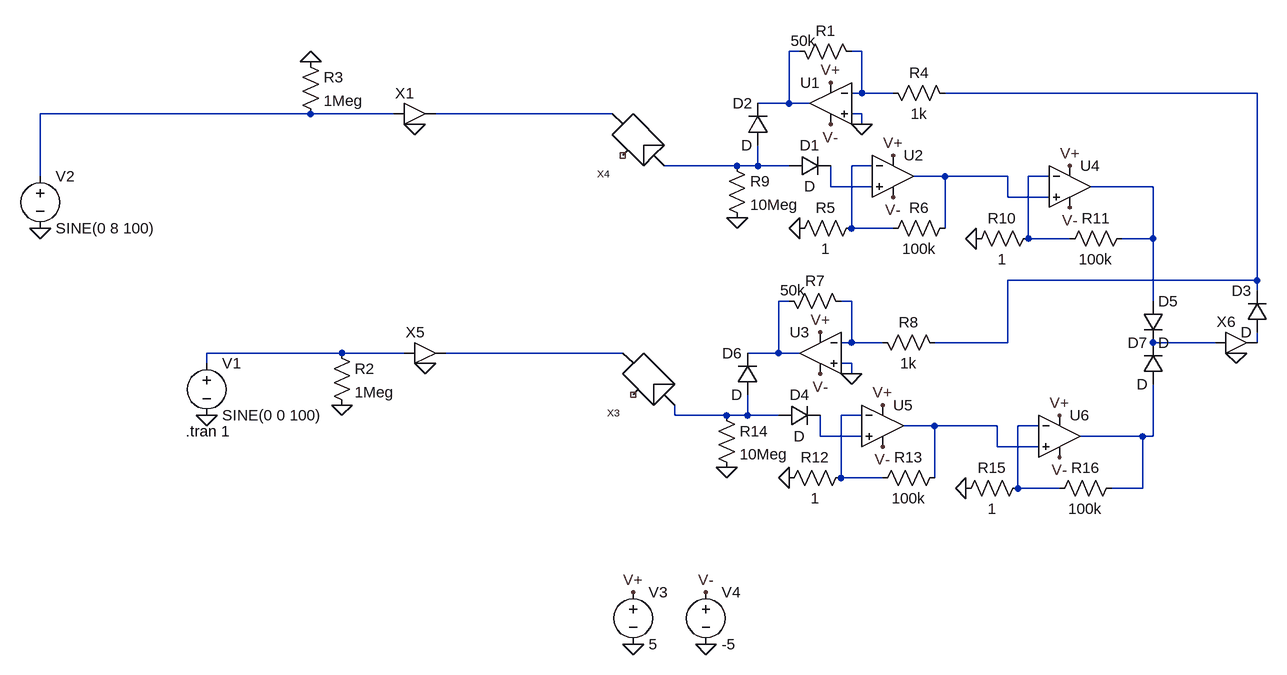
[diagram p0: schematic Draft1.asc]
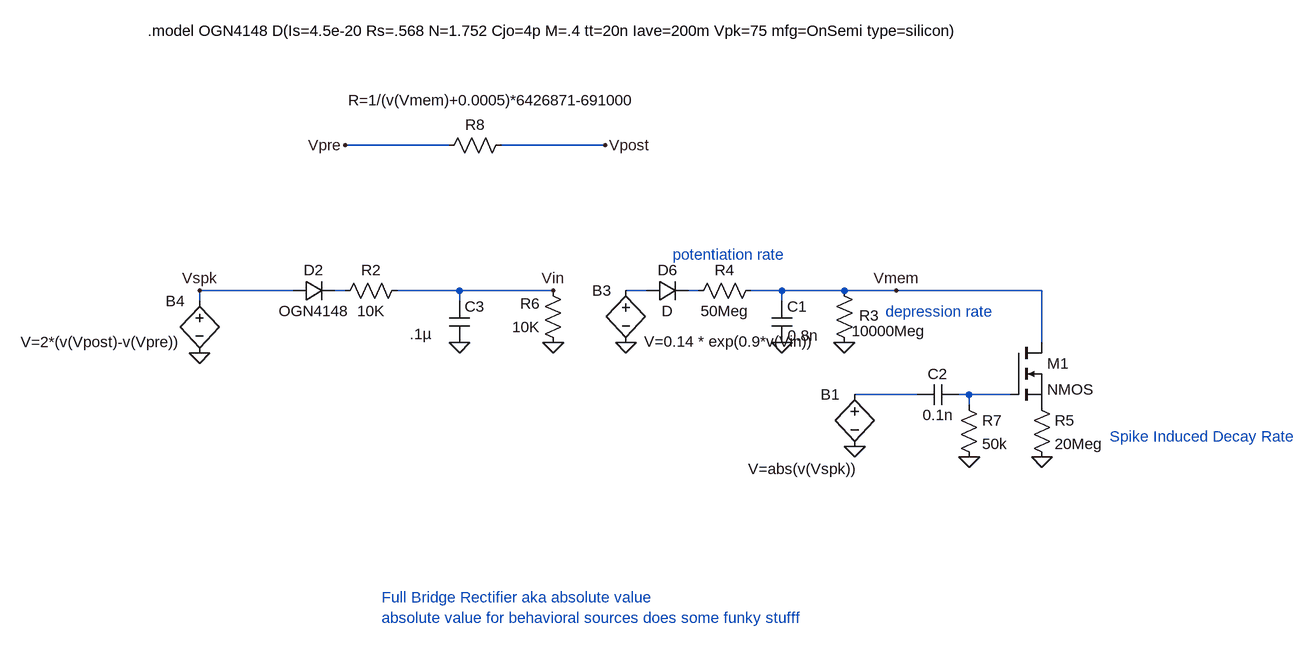
[diagram p1: sub-circuit synapse.asc]
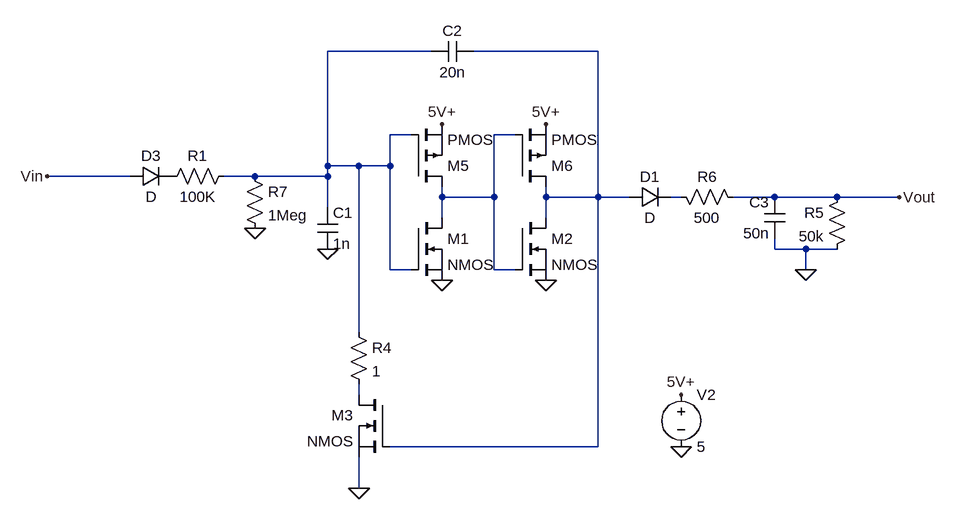
[diagram p2: sub-circuit ahp.asc]
Draft1.asc, the LTspice schematic file:
Version 4
SHEET 1 1428 692
WIRE 704 -240 688 -240
WIRE 800 -240 784 -240
WIRE 800 -176 800 -240
WIRE 800 -176 784 -176
WIRE 848 -176 800 -176
WIRE 1408 -176 928 -176
WIRE 688 -160 688 -240
WIRE 688 -160 640 -160
WIRE 720 -160 688 -160
WIRE -48 -144 -464 -144
WIRE 80 -144 -48 -144
WIRE 416 -144 144 -144
WIRE 800 -144 784 -144
WIRE 800 -128 800 -144
WIRE 608 -64 496 -64
WIRE 640 -64 640 -96
WIRE 640 -64 608 -64
WIRE 688 -64 640 -64
WIRE 816 -64 784 -64
WIRE -464 -48 -464 -144
WIRE 928 -48 880 -48
WIRE 1024 -48 928 -48
WIRE 1088 -48 1056 -48
WIRE 752 -32 752 -64
WIRE 816 -32 752 -32
WIRE 1248 -32 1152 -32
WIRE 1024 -16 1024 -48
WIRE 1088 -16 1024 -16
WIRE 784 32 784 -64
WIRE 848 32 784 32
WIRE 928 32 928 -48
WIRE 1056 48 1056 -48
WIRE 1120 48 1056 48
WIRE 1248 48 1248 -32
WIRE 1248 48 1200 48
WIRE 1408 112 1408 -176
WIRE 1408 112 1024 112
WIRE 1408 128 1408 112
WIRE 688 144 672 144
WIRE 784 144 768 144
WIRE 1248 144 1248 48
WIRE 784 208 784 144
WIRE 784 208 768 208
WIRE 832 208 784 208
WIRE 1024 208 1024 112
WIRE 1024 208 912 208
WIRE 1344 208 1248 208
WIRE 1408 208 1408 192
WIRE 0 224 -208 224
WIRE 96 224 0 224
WIRE 432 224 160 224
WIRE 672 224 672 144
WIRE 672 224 624 224
WIRE 704 224 672 224
WIRE -208 240 -208 224
WIRE 784 240 768 240
WIRE 784 256 784 240
WIRE 512 320 512 304
WIRE 592 320 512 320
WIRE 624 320 624 288
WIRE 624 320 592 320
WIRE 672 320 624 320
WIRE 800 320 768 320
WIRE 912 336 864 336
WIRE 1008 336 912 336
WIRE 1072 336 1040 336
WIRE 736 352 736 320
WIRE 800 352 736 352
WIRE 1232 352 1136 352
WIRE 1248 352 1248 272
WIRE 1248 352 1232 352
WIRE 1008 368 1008 336
WIRE 1072 368 1008 368
WIRE 768 416 768 320
WIRE 832 416 768 416
WIRE 912 416 912 336
WIRE 1040 432 1040 336
WIRE 1104 432 1040 432
WIRE 1232 432 1232 352
WIRE 1232 432 1184 432
FLAG -208 320 0
FLAG 128 240 0
FLAG -464 32 0
FLAG 1376 224 0
FLAG 112 -128 0
FLAG 448 672 0
FLAG 560 672 0
FLAG 448 592 V+
FLAG 560 592 V-
FLAG 0 304 0
FLAG -48 -224 0
FLAG 752 -128 V-
FLAG 752 -192 V+
FLAG 800 -128 0
FLAG 848 -16 V-
FLAG 848 -80 V+
FLAG 704 32 0
FLAG 608 16 0
FLAG 1120 0 V-
FLAG 1120 -64 V+
FLAG 976 48 0
FLAG 736 256 V-
FLAG 736 192 V+
FLAG 784 256 0
FLAG 832 368 V-
FLAG 832 304 V+
FLAG 688 416 0
FLAG 592 400 0
FLAG 1104 384 V-
FLAG 1104 320 V+
FLAG 960 432 0
SYMBOL voltage -208 224 R0
WINDOW 123 0 0 Left 2
WINDOW 39 0 0 Left 2
SYMATTR InstName V1
SYMATTR Value SINE(0 0 100)
SYMBOL voltage -464 -64 R0
WINDOW 123 0 0 Left 2
WINDOW 39 0 0 Left 2
SYMATTR InstName V2
SYMATTR Value SINE(0 8 100)
SYMBOL Synapse 512 304 R180
SYMATTR InstName X3
SYMBOL Synapse 496 -64 R180
SYMATTR InstName X4
SYMBOL voltage 448 576 R0
WINDOW 123 0 0 Left 2
WINDOW 39 0 0 Left 2
SYMATTR InstName V3
SYMATTR Value 5
SYMBOL voltage 560 576 R0
WINDOW 123 0 0 Left 2
WINDOW 39 0 0 Left 2
SYMATTR InstName V4
SYMATTR Value -5
SYMBOL AHP 1344 208 R0
SYMATTR InstName X6
SYMATTR SpiceLine Rinhibition = 5Meg
SYMBOL AHP 96 224 R0
SYMATTR InstName X5
SYMATTR SpiceLine Rinhibition = 5Meg
SYMBOL AHP 80 -144 R0
SYMATTR InstName X1
SYMATTR SpiceLine Rinhibition = 5Meg
SYMBOL res -16 208 R0
SYMATTR InstName R2
SYMATTR Value 1Meg
SYMBOL res -64 -240 R0
SYMATTR InstName R3
SYMATTR Value 1Meg
SYMBOL Opamps\\UniversalOpamp2 752 -160 M0
SYMATTR InstName U1
SYMBOL res 688 -256 M90
WINDOW 0 0 56 VBottom 2
WINDOW 3 -16 22 VTop 2
SYMATTR InstName R1
SYMATTR Value 50k
SYMBOL res 832 -192 M90
WINDOW 0 0 56 VBottom 2
WINDOW 3 32 56 VTop 2
SYMATTR InstName R4
SYMATTR Value 1k
SYMBOL Opamps\\UniversalOpamp2 848 -48 R0
SYMATTR InstName U2
SYMBOL res 688 48 R270
WINDOW 0 32 56 VTop 2
WINDOW 3 0 56 VBottom 2
SYMATTR InstName R5
SYMATTR Value 1
SYMBOL res 832 48 R270
WINDOW 0 32 56 VTop 2
WINDOW 3 0 56 VBottom 2
SYMATTR InstName R6
SYMATTR Value 100k
SYMBOL diode 688 -48 R270
WINDOW 0 32 32 VTop 2
WINDOW 3 0 32 VBottom 2
SYMATTR InstName D1
SYMBOL res 592 -80 R0
SYMATTR InstName R9
SYMATTR Value 10Meg
SYMBOL Opamps\\UniversalOpamp2 1120 -32 R0
SYMATTR InstName U4
SYMBOL res 960 64 R270
WINDOW 0 32 56 VTop 2
WINDOW 3 0 56 VBottom 2
SYMATTR InstName R10
SYMATTR Value 1
SYMBOL res 1104 64 R270
WINDOW 0 32 56 VTop 2
WINDOW 3 0 56 VBottom 2
SYMATTR InstName R11
SYMATTR Value 100k
SYMBOL diode 1424 192 R180
WINDOW 0 24 64 Left 2
WINDOW 3 24 0 Left 2
SYMATTR InstName D3
SYMBOL diode 656 -96 R180
WINDOW 0 24 64 Left 2
WINDOW 3 24 0 Left 2
SYMATTR InstName D2
SYMBOL Opamps\\UniversalOpamp2 736 224 M0
SYMATTR InstName U3
SYMBOL res 672 128 M90
WINDOW 0 0 56 VBottom 2
WINDOW 3 -16 22 VTop 2
SYMATTR InstName R7
SYMATTR Value 50k
SYMBOL res 816 192 M90
WINDOW 0 0 56 VBottom 2
WINDOW 3 32 56 VTop 2
SYMATTR InstName R8
SYMATTR Value 1k
SYMBOL Opamps\\UniversalOpamp2 832 336 R0
SYMATTR InstName U5
SYMBOL res 672 432 R270
WINDOW 0 32 56 VTop 2
WINDOW 3 0 56 VBottom 2
SYMATTR InstName R12
SYMATTR Value 1
SYMBOL res 816 432 R270
WINDOW 0 32 56 VTop 2
WINDOW 3 0 56 VBottom 2
SYMATTR InstName R13
SYMATTR Value 100k
SYMBOL diode 672 336 R270
WINDOW 0 32 32 VTop 2
WINDOW 3 0 32 VBottom 2
SYMATTR InstName D4
SYMBOL res 576 304 R0
SYMATTR InstName R14
SYMATTR Value 10Meg
SYMBOL Opamps\\UniversalOpamp2 1104 352 R0
SYMATTR InstName U6
SYMBOL res 944 448 R270
WINDOW 0 32 56 VTop 2
WINDOW 3 0 56 VBottom 2
SYMATTR InstName R15
SYMATTR Value 1
SYMBOL res 1088 448 R270
WINDOW 0 32 56 VTop 2
WINDOW 3 0 56 VBottom 2
SYMATTR InstName R16
SYMATTR Value 100k
SYMBOL diode 640 288 R180
WINDOW 0 24 64 Left 2
WINDOW 3 24 0 Left 2
SYMATTR InstName D6
SYMBOL diode 1232 144 R0
SYMATTR InstName D5
SYMBOL diode 1264 272 R180
WINDOW 0 24 64 Left 2
WINDOW 3 24 0 Left 2
SYMATTR InstName D7
TEXT -240 344 Left 2 !.tran 1

synapse.asc, the sub-circuit schematic file:
Version 4
SHEET 1 2576 1444
WIRE 336 416 176 416
WIRE 576 416 416 416
WIRE 96 640 -48 640
WIRE 176 640 160 640
WIRE 352 640 256 640
WIRE 496 640 352 640
WIRE 640 640 608 640
WIRE 720 640 704 640
WIRE 848 640 800 640
WIRE 944 640 848 640
WIRE 1024 640 944 640
WIRE 1248 640 1024 640
WIRE -48 656 -48 640
WIRE 352 656 352 640
WIRE 848 656 848 640
WIRE 1248 720 1248 640
WIRE 1056 800 960 800
WIRE 1136 800 1120 800
WIRE 1200 800 1136 800
WIRE 1136 816 1136 800
FLAG -48 736 0
FLAG 176 416 Vpre
FLAG 576 416 Vpost
FLAG 352 720 0
FLAG 496 720 0
FLAG 496 640 Vin
FLAG -48 640 Vspk
FLAG 960 880 0
FLAG 944 720 0
FLAG 848 720 0
FLAG 608 720 0
FLAG 1248 896 0
FLAG 1136 896 0
FLAG 1024 640 Vmem
SYMBOL res 512 736 R180
WINDOW 0 36 76 Left 2
WINDOW 3 36 40 Left 2
SYMATTR InstName R6
SYMATTR Value 10K
SYMBOL bv -48 640 R0
WINDOW 0 -52 16 Left 2
WINDOW 3 -275 79 Left 2
SYMATTR InstName B4
SYMATTR Value V=2*(v(Vpost)-v(Vpre))
SYMBOL res 432 400 R90
WINDOW 0 0 56 VBottom 2
WINDOW 3 -69 27 VTop 2
SYMATTR InstName R8
SYMATTR Value R=1/(v(Vmem)+0.0005)*6426871-691000
SYMBOL cap 336 656 R0
WINDOW 3 -61 51 Left 2
SYMATTR Value .1µ
SYMATTR InstName C3
SYMATTR SpiceLine V=16 Irms=7.41 Rser=0.000 Lser=0
SYMBOL diode 96 656 R270
WINDOW 0 32 32 VTop 2
WINDOW 3 0 32 VBottom 2
SYMATTR InstName D2
SYMATTR Value OGN4148
SYMBOL res 272 624 R90
WINDOW 0 0 56 VBottom 2
WINDOW 3 32 56 VTop 2
SYMATTR InstName R2
SYMATTR Value 10K
SYMBOL bv 960 784 R0
WINDOW 0 -52 16 Left 2
WINDOW 3 -164 130 Left 2
SYMATTR InstName B1
SYMATTR Value V=abs(v(Vspk))
SYMBOL cap 832 656 R0
WINDOW 3 25 53 Left 2
SYMATTR Value 0.8n
SYMATTR InstName C1
SYMATTR SpiceLine V=16 Irms=7.41 Rser=0.000 Lser=0
SYMBOL res 960 736 R180
WINDOW 0 -38 58 Left 2
WINDOW 3 -110 34 Left 2
SYMATTR InstName R3
SYMATTR Value 10000Meg
SYMBOL res 816 624 R90
WINDOW 0 0 56 VBottom 2
WINDOW 3 32 56 VTop 2
SYMATTR InstName R4
SYMATTR Value 50Meg
SYMBOL bv 608 624 R0
WINDOW 0 -52 16 Left 2
WINDOW 3 28 94 Left 2
SYMATTR InstName B3
SYMATTR Value V=0.14 * exp(0.9*v(Vin))
SYMBOL nmos 1200 720 R0
SYMATTR InstName M1
SYMBOL res 1232 800 R0
SYMATTR InstName R5
SYMATTR Value 20Meg
SYMBOL cap 1120 784 R90
WINDOW 0 0 32 VBottom 2
WINDOW 3 32 32 VTop 2
SYMATTR InstName C2
SYMATTR Value 0.1n
SYMBOL res 1120 800 R0
SYMATTR InstName R7
SYMATTR Value 50k
SYMBOL diode 640 656 R270
WINDOW 0 32 32 VTop 2
WINDOW 3 0 32 VBottom 2
SYMATTR InstName D6
TEXT -128 240 Left 2 !.model OGN4148 D(Is=4.5e-20 Rs=.568 N=1.752 Cjo=4p M=.4 tt=20n Iave=200m Vpk=75 mfg=OnSemi type=silicon)
TEXT 680 584 Left 2 ;potentiation rate
TEXT 1008 672 Left 2 ;depression rate
TEXT 1352 864 Left 2 ;Spike Induced Decay Rate
TEXT 232 1112 Left 2 ;Full Bridge Rectifier aka absolute value\nabsolute value for behavioral sources does some funky stufff

ahp.asc, the sub-circuit schematic file:
Version 4
SHEET 1 1244 680
WIRE 384 -144 224 -144
WIRE 640 -144 448 -144
WIRE 352 -16 320 -16
WIRE 512 -16 480 -16
WIRE 224 32 224 -144
WIRE 272 32 224 32
WIRE 320 32 320 -16
WIRE 320 32 272 32
WIRE -80 48 -208 48
WIRE 112 48 64 48
WIRE 224 48 224 32
WIRE 224 48 112 48
WIRE 400 80 400 64
WIRE 480 80 480 -16
WIRE 480 80 400 80
WIRE 560 80 560 64
WIRE 640 80 640 -144
WIRE 640 80 560 80
WIRE 688 80 640 80
WIRE 768 80 752 80
WIRE 912 80 848 80
WIRE 1008 80 912 80
WIRE 1104 80 1008 80
WIRE 224 96 224 48
WIRE 400 112 400 80
WIRE 560 112 560 80
WIRE 912 160 912 144
WIRE 960 160 912 160
WIRE 1008 160 960 160
WIRE 320 192 320 32
WIRE 352 192 320 192
WIRE 480 192 480 80
WIRE 512 192 480 192
WIRE 960 192 960 160
WIRE 272 288 272 32
WIRE 272 384 272 368
WIRE 640 464 640 80
WIRE 640 464 320 464
WIRE 272 528 272 480
FLAG 768 464 0
FLAG 768 384 5V+
FLAG 224 160 0
FLAG 400 -32 5V+
FLAG 560 -32 5V+
FLAG 560 208 0
FLAG 400 208 0
FLAG 272 528 0
FLAG -208 48 Vin
FLAG 1104 80 Vout
FLAG 960 192 0
FLAG 112 128 0
SYMBOL res 80 32 R90
WINDOW 0 0 56 VBottom 2
WINDOW 3 32 56 VTop 2
SYMATTR InstName R1
SYMATTR Value 100K
SYMBOL cap 208 96 R0
SYMATTR InstName C1
SYMATTR Value 1n
SYMBOL cap 448 -160 R90
WINDOW 0 0 32 VBottom 2
WINDOW 3 32 32 VTop 2
SYMATTR InstName C2
SYMATTR Value 20n
SYMBOL voltage 768 368 R0
WINDOW 123 0 0 Left 2
WINDOW 39 0 0 Left 2
SYMATTR InstName V2
SYMATTR Value 5
SYMBOL nmos 320 384 M0
SYMATTR InstName M3
SYMBOL nmos 352 112 R0
SYMATTR InstName M1
SYMBOL nmos 512 112 R0
SYMATTR InstName M2
SYMBOL pmos 352 64 M180
SYMATTR InstName M5
SYMBOL pmos 512 64 M180
SYMATTR InstName M6
SYMBOL diode -80 64 R270
WINDOW 0 32 32 VTop 2
WINDOW 3 0 32 VBottom 2
SYMATTR InstName D3
SYMBOL res 256 272 R0
SYMATTR InstName R4
SYMATTR Value 1
SYMBOL res 1024 64 M0
SYMATTR InstName R5
SYMATTR Value 50k
SYMBOL cap 928 80 M0
SYMATTR InstName C3
SYMATTR Value 50n
SYMBOL res 752 64 M90
WINDOW 0 0 56 VBottom 2
WINDOW 3 32 56 VTop 2
SYMATTR InstName R6
SYMATTR Value 500
SYMBOL diode 688 96 R270
WINDOW 0 32 32 VTop 2
WINDOW 3 0 32 VBottom 2
SYMATTR InstName D1
SYMBOL res 96 32 R0
SYMATTR InstName R7
SYMATTR Value 1Meg

The netlist it stands for:
* Draft1.asc
V1 N016 0 SINE(0 0 100)
V2 N004 0 SINE(0 8 100)
XX3 N018 N017 NC_01 synapse
XX4 N006 N005 NC_02 synapse
V3 V+ 0 5
V4 V- 0 -5
XX6 N014 N015 0 ahp params: AHP Rinhibition = 5Meg
XX5 N016 N017 0 ahp params: AHP Rinhibition = 5Meg
XX1 N004 N005 0 ahp params: AHP Rinhibition = 5Meg
R2 N016 0 1Meg
R3 0 N004 1Meg
XU1 0 N002 V+ V- N001 level.2 Avol=1Meg GBW=10Meg Slew=10Meg ilimit=25m rail=0 Vos=0 phimargin=45 en=0 enk=0 in=0 ink=0 Rin=500Meg  ; pins IN+ IN- V+ V- OUT
R1 N001 N002 50k
R4 N002 N003 1k
XU2 N010 N007 V+ V- N008 level.2 Avol=1Meg GBW=10Meg Slew=10Meg ilimit=25m rail=0 Vos=0 phimargin=45 en=0 enk=0 in=0 ink=0 Rin=500Meg  ; pins IN+ IN- V+ V- OUT
R5 0 N007 1
R6 N007 N008 100k
D1 N006 N010 D
R9 N006 0 10Meg
XU4 N008 N009 V+ V- N011 level.2 Avol=1Meg GBW=10Meg Slew=10Meg ilimit=25m rail=0 Vos=0 phimargin=45 en=0 enk=0 in=0 ink=0 Rin=500Meg  ; pins IN+ IN- V+ V- OUT
R10 0 N009 1
R11 N009 N011 100k
D3 N015 N003 D
D2 N006 N001 D
XU3 0 N013 V+ V- N012 level.2 Avol=1Meg GBW=10Meg Slew=10Meg ilimit=25m rail=0 Vos=0 phimargin=45 en=0 enk=0 in=0 ink=0 Rin=500Meg  ; pins IN+ IN- V+ V- OUT
R7 N012 N013 50k
R8 N013 N003 1k
XU5 N022 N019 V+ V- N020 level.2 Avol=1Meg GBW=10Meg Slew=10Meg ilimit=25m rail=0 Vos=0 phimargin=45 en=0 enk=0 in=0 ink=0 Rin=500Meg  ; pins IN+ IN- V+ V- OUT
R12 0 N019 1
R13 N019 N020 100k
D4 N018 N022 D
R14 N018 0 10Meg
XU6 N020 N021 V+ V- N023 level.2 Avol=1Meg GBW=10Meg Slew=10Meg ilimit=25m rail=0 Vos=0 phimargin=45 en=0 enk=0 in=0 ink=0 Rin=500Meg  ; pins IN+ IN- V+ V- OUT
R15 0 N021 1
R16 N021 N023 100k
D6 N018 N012 D
D5 N011 N014 D
D7 N023 N014 D

* block symbol definitions
.subckt synapse Vpre Vpost Vmem
R6 0 Vin 10K
B4 Vspk 0 V=2*(v(Vpost)-v(Vpre))
R8 Vpost Vpre R=1/(v(Vmem)+0.0005)*6426871-691000
C3 Vin 0 .1µ V=16 Irms=7.41 Rser=0.000 Lser=0
D2 Vspk N001 OGN4148
R2 Vin N001 10K
B1 N004 0 V=abs(v(Vspk))
C1 Vmem 0 0.8n V=16 Irms=7.41 Rser=0.000 Lser=0
R3 0 Vmem 10000Meg
R4 Vmem N003 50Meg
B3 N002 0 V=0.14 * exp(0.9*v(Vin))
M1 Vmem N005 P001 P001 NMOS
R5 P001 0 20Meg
C2 N005 N004 0.1n
R7 N005 0 50k
D6 N002 N003 D
.model OGN4148 D(Is=4.5e-20 Rs=.568 N=1.752 Cjo=4p M=.4 tt=20n Iave=200m Vpk=75 mfg=OnSemi type=silicon)
* potentiation rate
* depression rate
* Spike Induced Decay Rate
* Full Bridge Rectifier aka absolute value
* absolute value for behavioral sources does some funky stufff
.ends synapse

.subckt ahp Vin Vout 5V+
R1 N001 P001 100K
C1 N001 0 1n
C2 N002 N001 20n
V2 5V+ 0 5
M3 N005 N002 0 0 NMOS
M1 N003 N001 0 0 NMOS
M2 N002 N003 0 0 NMOS
M5 N003 N001 5V+ 5V+ PMOS
M6 N002 N003 5V+ 5V+ PMOS
D3 Vin P001 D
R4 N001 N005 1
R5 Vout 0 50k
C3 Vout 0 50n
R6 N004 Vout 500
D1 N002 N004 D
R7 N001 0 1Meg
.ends ahp

.model D D
.lib standard.dio
.model NMOS NMOS
.model PMOS PMOS
.lib standard.mos
.tran 1
.lib UniversalOpamps2.sub
.backanno
.end